# EAGLE design Nano_C1101_ds (EAGLE 9.5.2)
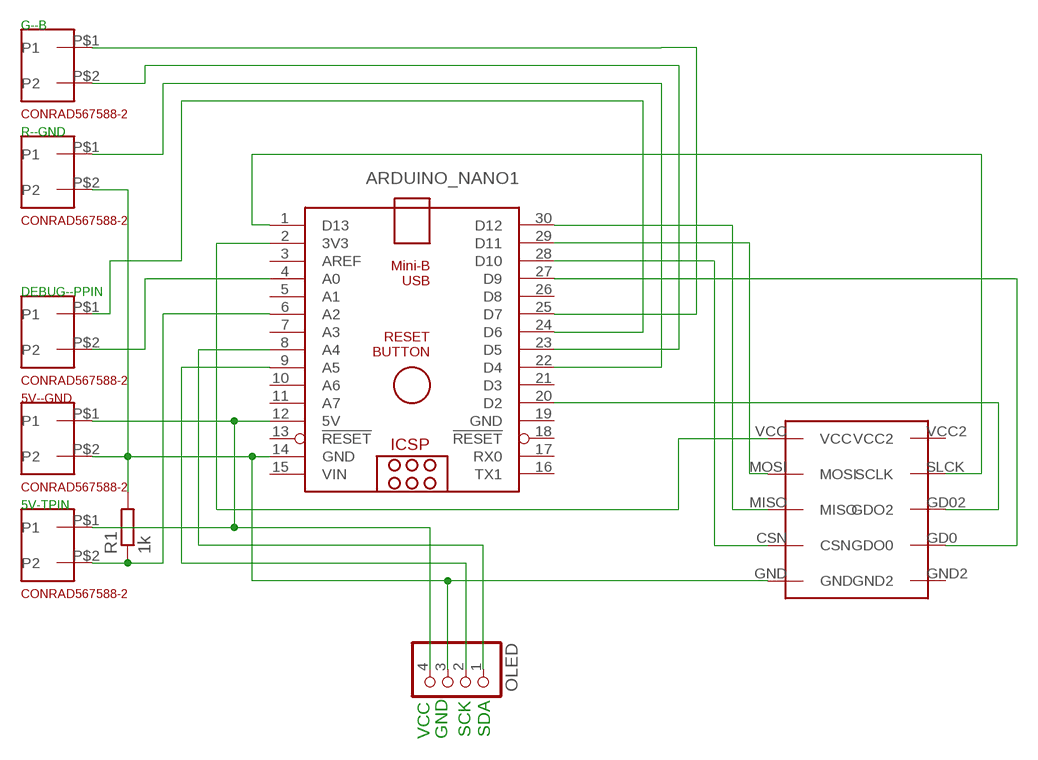
[diagram p0: schematic, sheet 1]

## Parts
5V--GND  CONRAD567588-2  [CONRAD567588]
5V-TPIN  CONRAD567588-2  [CONRAD567588]
ARDUINO_NANO1  ARDUINO_NANO  [ARDUINO_NANO]
DEBUG--PPIN  CONRAD567588-2  [CONRAD567588]
G--B  CONRAD567588-2  [CONRAD567588]
OLED  PINHD-1X4  [1X04]
R1  1k  R-EU_0204/7  [0204/7]
R--GND  CONRAD567588-2  [CONRAD567588]
U$1  NEUFTECH_CC1101  [NEUFTECH_CC1101_PACKAGE_BOTTOM_VIEW]

## Nets
3V3: ARDUINO_NANO1.2(3V3) U$1.VCC
5V: 5V--GND.P$1(P1) 5V-TPIN.P$1(P1) ARDUINO_NANO1.12(5V) OLED.4
B-RGB: ARDUINO_NANO1.23(D5) G--B.P$2(P2)
CSN: ARDUINO_NANO1.28(D10) U$1.CSN
DEBUG: ARDUINO_NANO1.24(D6) DEBUG--PPIN.P$1(P1)
G-RGB: ARDUINO_NANO1.25(D7) G--B.P$1(P1)
GDO0: ARDUINO_NANO1.27(D9) U$1.GD0(GDO0)
GDO2: ARDUINO_NANO1.20(D2) U$1.GD02(GDO2)
GND: 5V--GND.P$2(P2) ARDUINO_NANO1.14(GND) OLED.3 R1.2 R--GND.P$2(P2) U$1.GND
MISO: ARDUINO_NANO1.30(D12) U$1.MISO
MOSI: ARDUINO_NANO1.29(D11) U$1.MOSI
PPIN: ARDUINO_NANO1.4(A0) DEBUG--PPIN.P$2(P2)
R-RGB: ARDUINO_NANO1.22(D4) R--GND.P$1(P1)
SCK: ARDUINO_NANO1.9(A5) OLED.2
SCLK: ARDUINO_NANO1.1(D13) U$1.SLCK(SCLK)
SDA: ARDUINO_NANO1.8(A4) OLED.1
TPIN: 5V-TPIN.P$2(P2) ARDUINO_NANO1.6(A2) R1.1
Unconnected: ARDUINO_NANO1.3(AREF) ARDUINO_NANO1.5(A1) ARDUINO_NANO1.7(A3) ARDUINO_NANO1.10(A6) ARDUINO_NANO1.11(A7) ARDUINO_NANO1.13(!RESET) ARDUINO_NANO1.16(TX1) ARDUINO_NANO1.17(RX0) ARDUINO_NANO1.18(!RESET) ARDUINO_NANO1.21(D3) ARDUINO_NANO1.26(D8) U$1.GND2 U$1.VCC2

## Notes on the sheet
- VCC | GND | SCK | SDA

## Power pins joined to a net without a drawn wire
GND: ARDUINO_NANO1.19(GND)
VIN: ARDUINO_NANO1.15(VIN)

## Library data of the parts
5V--GND 5V-TPIN DEBUG--PPIN G--B R--GND = johannes:CONRAD567588-2
ARDUINO_NANO1 = ArduinoNanoV30:ARDUINO_NANO: Arduino Nano V3.0 Overview: The Arduino Nano is a small, complete, and breadboard-friendly board based on the ATmega328 (Arduino Nano 3.x) or ATmega168 (Arduino Nano 2.x). It has more or less the same functionality of the Arduino Duemilanove, but in a different package. It lacks only a DC power jack, and works with a Mini-B USB cable instead of a standard one. The Nano was designed and is being produced by Gravitech. Specifications: Microcontroller Atmel ATmega168 or ATmega328 Operating Voltage (logic level) 5 V Input Voltage (recommended) 7-12 V Input Voltage (limits) 6-20 V Digital I/O Pins 14 (of which 6 provide PWM output) Analog Input Pins 8 DC Current per I/O Pin 40 mA Flash Memory 16 KB (ATmega168) or 32 KB (ATmega328) of which 2 KB used by bootloader SRAM 1 KB (ATmega168) or 2 KB (ATmega328) EEPROM 512 bytes (ATmega168) or 1 KB (ATmega328) Clock Speed 16 MHz Dimensions 0.73" x 1.70" Length 45 mm Width 18 mm Weigth 5 g Power: The Arduino Nano can be powered via the Mini-B USB connection, 6-20V unregulated external power supply (pin 30), or 5V regulated external power supply (pin 27). The power source is automatically selected to the highest voltage source. Memory: The ATmega168 has 16 KB of flash memory for storing code (of which 2 KB is used for the bootloader); the ATmega328 has 32 KB, (also with 2 KB used for the bootloader). The ATmega168 has 1 KB of SRAM and 512 bytes of EEPROM (which can be read and written with the EEPROM library); the ATmega328 has 2 KB of SRAM and 1 KB of EEPROM. Input and Output: Each of the 14 digital pins on the Nano can be used as an input or output, using pinMode(), digitalWrite(), and digitalRead() functions. They operate at 5 volts. Each pin can provide or receive a maximum of 40 mA and has an internal pull-up resistor (disconnected by default) of 20-50 kOhms. In addition, some pins have specialized functions. Visit Arduino - ArduinoBoardNano <https://www.arduino.cc/en/Main/ArduinoBoardNano>
OLED = pinhead:PINHD-1X4: PIN HEADER
R1 = rcl:R-EU_: RESISTOR, European symbol; SPICEPREFIX: R
U$1 = johannes:NEUFTECH_CC1101

## Board
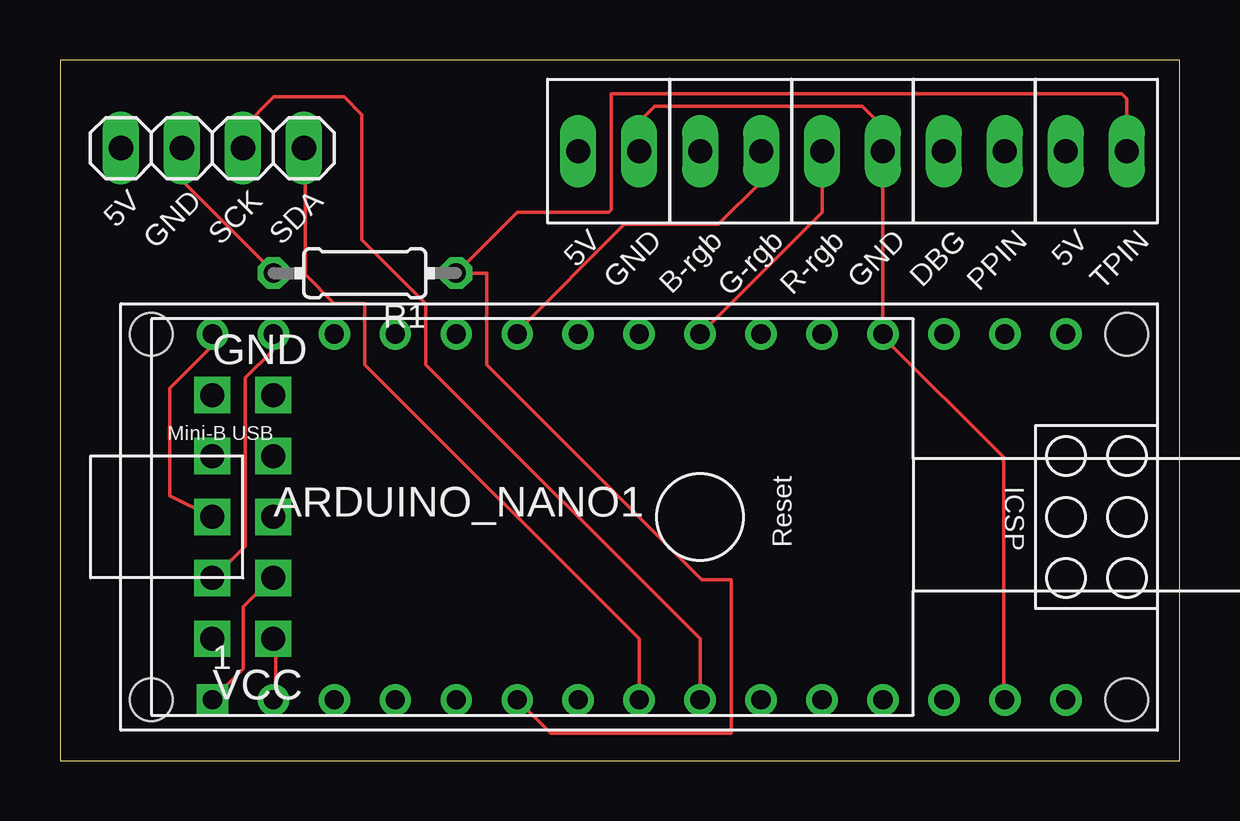
[diagram p1: board, top side]
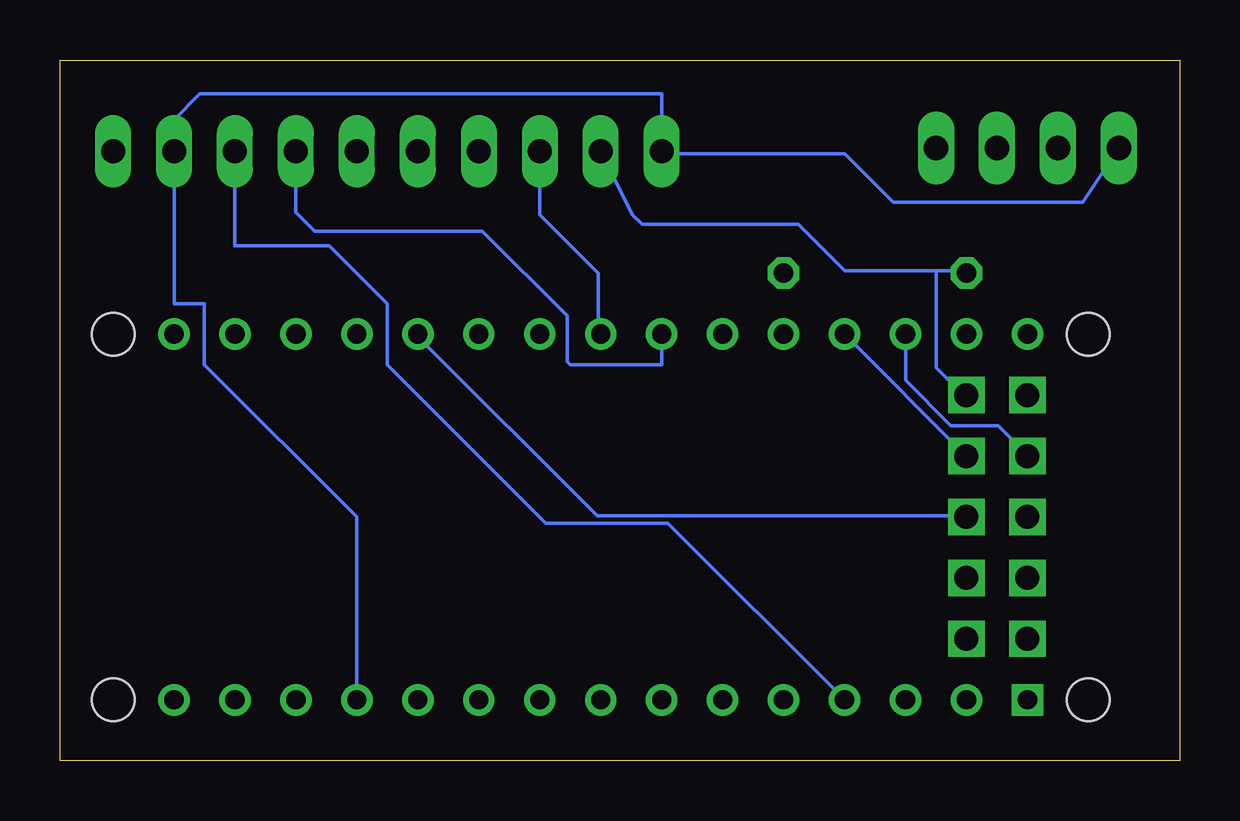
[diagram p2: board, bottom side, seen from below]

Size 46.66 x 29.2 mm. Coordinates in mm from the lower left corner, seen from the top.
Outline: 0,0 46.66,0 46.66,29.2 0,29.2 0,0
Copper layers (1*16): Top 0.035mm / dielectric 1.5mm / Bottom 0.035mm
Design rules "default": minimum track width 6mil, minimum drill 0.35mm, track to track 6mil, track to pad 6mil, pad to pad 6mil, via to via 6mil, smd to smd 6mil, copper to edge 40mil, drill to drill 6mil, minimum pad ring 10mil, minimum via ring 8mil, stop-mask expansion 4mil, vias tented up to drill 0mil, thermal gap 10mil

### Footprints (pad centres in the part's own frame; a part is rotated, then mirrored left to right if it is on the bottom)
CONRAD567588 = drill 1 long: P$1 -1.27,0; P$2 1.27,0
ARDUINO_NANO = drill 0.8 square: 1 -20.32,-7.62 | drill 0.8: 2 -17.78,-7.62; 3 -15.24,-7.62; 4 -12.7,-7.62; 5 -10.16,-7.62; 6 -7.62,-7.62; 7 -5.08,-7.62; 8 -2.54,-7.62; 9 0,-7.62; 10 2.54,-7.62; 11 5.08,-7.62; 12 7.62,-7.62; 13 10.16,-7.62; 14 12.7,-7.62; 15 15.24,-7.62; 16 15.24,7.62; 17 12.7,7.62; 18 10.16,7.62; 19 7.62,7.62; 20 5.08,7.62; 21 2.54,7.62; 22 0,7.62; 23 -2.54,7.62; 24 -5.08,7.62; 25 -7.62,7.62; 26 -10.16,7.62; 27 -12.7,7.62; 28 -15.24,7.62; 29 -17.78,7.62; 30 -20.32,7.62 | hole 1.778: -22.86,-7.62; -22.86,7.62; 17.78,7.62; 17.78,-7.62
1X04 = drill 1.016 long: 1 -3.81,0; 2 -1.27,0; 3 1.27,0; 4 3.81,0
0204/7 = drill 0.813 octagon: 1 -3.81,0; 2 3.81,0
NEUFTECH_CC1101_PACKAGE_BOTTOM_VIEW = drill 1 square: CSN 2.54,0; GD0 2.54,2.54; GD02 5.08,2.54; GND 0,2.54; GND2 0,0; MISO 5.08,0; MOSI 7.62,0; SLCK 7.62,2.54; VCC 10.16,2.54; VCC2 10.16,0

### Placement (x,y rotation side)
5V--GND  22.86,25.4 0 top
5V-TPIN  43.18,25.4 0 top
ARDUINO_NANO1  26.67,10.16 0 top
DEBUG--PPIN  38.1,25.4 0 top
G--B  27.94,25.4 180 top
OLED  6.35,25.53 180 top
R1  12.7,20.32 180 top
R--GND  33.02,25.4 0 top
U$1  6.35,15.24 270 top

### Tracks (layer width: path | path; a pad name or v marks a point on that pad's centre or on a via)
3V3
  Top 0.152: ARDUINO_NANO1.2 8.99,2.59 8.99,5.03 U$1.VCC
5V
  Bottom 0.152: OLED.4 4.05,23.27 11.94,23.27 13.97,25.3 21.49,25.3 5V--GND.P$1 21.59,27.79 40.84,27.79 41.91,26.72 5V-TPIN.P$1 41.91,19.05 40.64,19.05 40.64,16.51 34.29,10.16 ARDUINO_NANO1.12
B-RGB
  Bottom 0.152: ARDUINO_NANO1.23 24.23,17.83 24.23,20.32 26.67,22.76 G--B.P$2
CSN
  Bottom 0.152: ARDUINO_NANO1.28 11.43,15.85 9.55,13.97 7.57,13.97 6.4,12.8 U$1.CSN
DEBUG
  Bottom 0.152: DEBUG--PPIN.P$1 36.83,22.86 36.04,22.07 29.06,22.07 25.53,18.54 25.53,16.64 25.4,16.51 21.59,16.51 ARDUINO_NANO1.24
G-RGB
  Top 0.152: ARDUINO_NANO1.25 19.05,17.88 23.52,22.35 27.43,22.35 29.21,24.13 G--B.P$1
GDO0
  Bottom 0.152: U$1.GD0 ARDUINO_NANO1.27
GDO2
  Bottom 0.152: ARDUINO_NANO1.20 31.75,17.68 24.28,10.21 8.99,10.21 U$1.GD02
GND
  Top 0.152: OLED.3 5.18,25.45 5.18,24.08 8.84,20.42 R1.2 | ARDUINO_NANO1.14 39.32,2.59 39.32,12.65 34.29,17.68 ARDUINO_NANO1.19 R--GND.P$2 34.29,26.42 33.43,27.28 24.79,27.28 24.13,26.62 5V--GND.P$2
  Bottom 0.152: 10.16,20.42 13.97,20.42 15.9,22.35 22.4,22.35 22.81,22.76 5V--GND.P$2 | 10.16,20.42 8.99,20.42 R1.2 | U$1.GND 9.02,15.24 10.16,16.38 10.16,20.42
MISO
  Top 0.152: ARDUINO_NANO1.30 6.25,17.68 6.25,17.2 4.57,15.52 4.57,11.05 U$1.MISO
MOSI
  Top 0.152: ARDUINO_NANO1.29 8.84,17.68 8.84,17.07 7.72,15.95 7.72,8.94 6.4,7.62 U$1.MOSI
PPIN
  Bottom 0.152: ARDUINO_NANO1.4 21.34,9.91 26.42,9.91 33.02,16.51 33.02,19.05 35.43,21.46 39.37,21.46 39.37,24.03 39.32,24.08 39.32,25.3 DEBUG--PPIN.P$2
R-RGB
  Top 0.152: R--GND.P$1 31.75,22.86 ARDUINO_NANO1.22
SCK
  Top 0.152: ARDUINO_NANO1.9 26.67,5.08 15.24,16.51 15.24,19.05 12.57,21.72 12.57,26.92 11.84,27.66 8.91,27.66 7.62,26.36 OLED.2
SCLK
  Top 0.152: ARDUINO_NANO1.1 7.64,3.83 7.64,6.43 8.84,7.62 U$1.SLCK
SDA
  Top 0.152: OLED.1 10.21,25.45 10.21,20.27 11.43,19.05 12.7,19.05 12.7,16.51 24.13,5.08 ARDUINO_NANO1.8
TPIN
  Top 0.152: ARDUINO_NANO1.6 19.05,2.44 19.15,2.44 20.45,1.14 27.96,1.14 27.96,7.54 26.75,7.54 17.78,16.51 17.78,20.32 R1.1 19.05,22.86 22.86,22.86 22.96,22.96 22.96,27.79 44.25,27.79 44.45,27.58 5V-TPIN.P$2

### Text on the board
tNames: 5V | GND | SCK | SDA | 5V | GND | B-rgb | G-rgb | R-rgb | GND | DBG | PPIN | 5V | TPIN